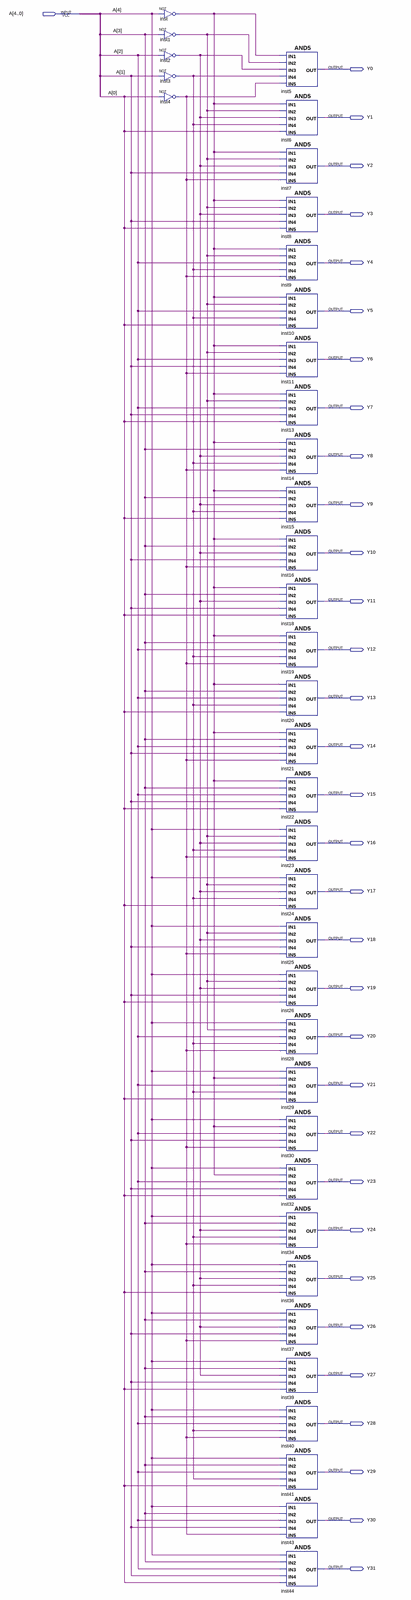
[diagram p0: schematic sheet, whole]
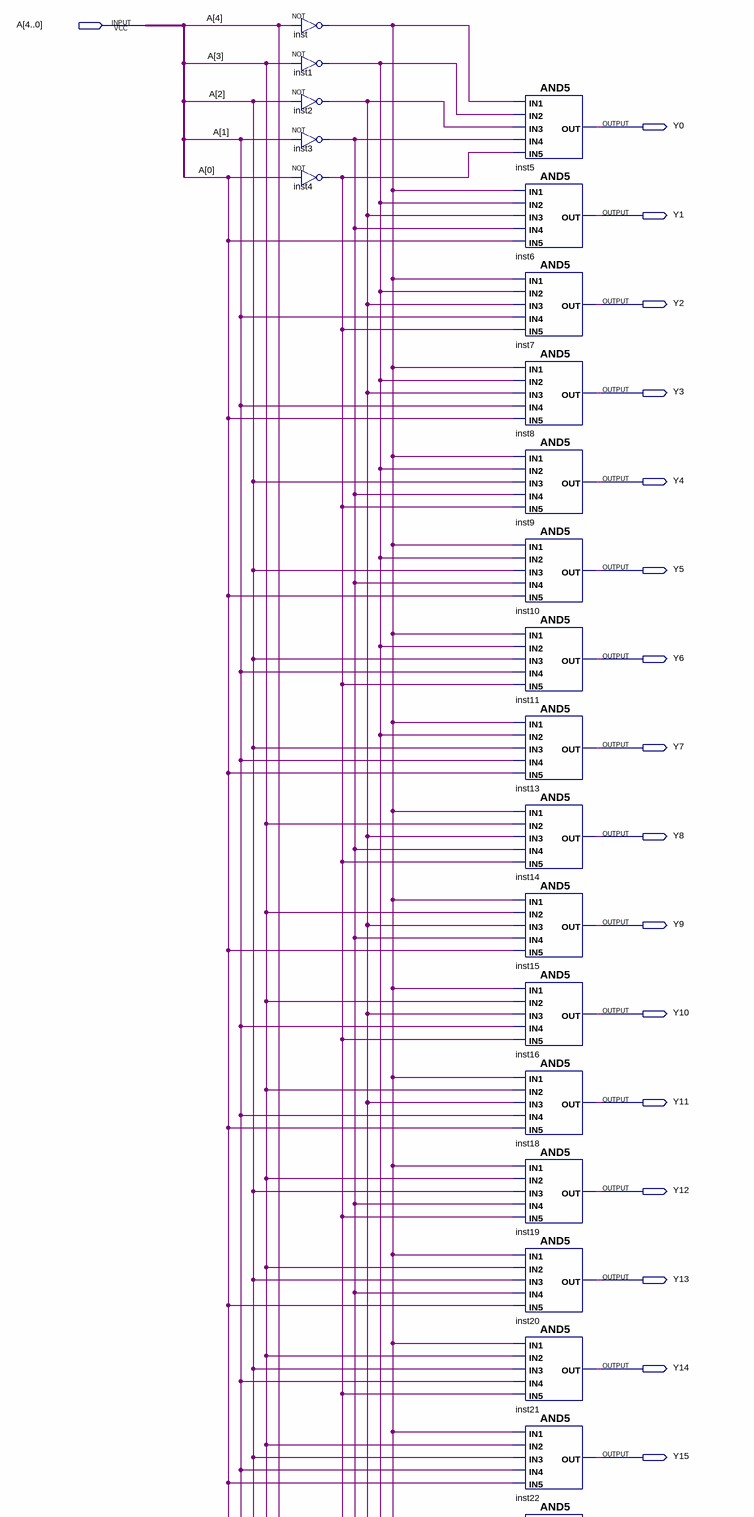
[diagram p1: schematic sheet, upper part]
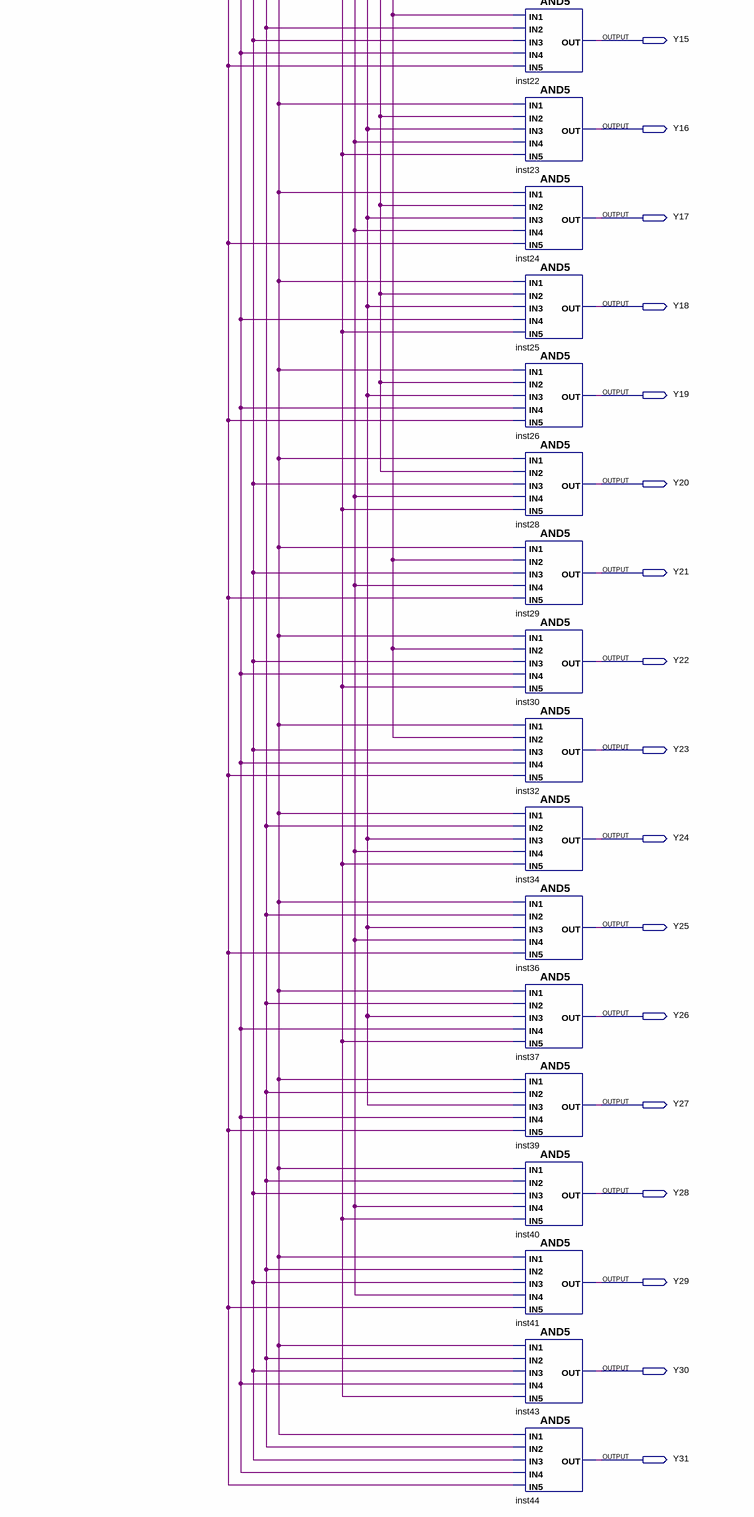
[diagram p2: schematic sheet, lower part]
// Quartus schematic decoder532.bdf as structural Verilog: 37 symbols, 33 pins
module decoder532 (
  input  [4:0] A,
  output Y0,
  output Y1,
  output Y2,
  output Y3,
  output Y4,
  output Y5,
  output Y6,
  output Y7,
  output Y8,
  output Y9,
  output Y10,
  output Y11,
  output Y12,
  output Y13,
  output Y14,
  output Y15,
  output Y16,
  output Y17,
  output Y18,
  output Y19,
  output Y20,
  output Y21,
  output Y22,
  output Y23,
  output Y24,
  output Y25,
  output Y26,
  output Y27,
  output Y28,
  output Y29,
  output Y30,
  output Y31
);

  wire inst1_out, inst2_out, inst3_out, inst4_out, inst_out;

  not inst (inst_out, A[4]);
  not inst1 (inst1_out, A[3]);
  not inst2 (inst2_out, A[2]);
  not inst3 (inst3_out, A[1]);
  not inst4 (inst4_out, A[0]);
  and inst5 (Y0, inst_out, inst1_out, inst2_out, inst3_out, inst4_out);
  and inst6 (Y1, inst_out, inst1_out, inst2_out, inst3_out, A[0]);
  and inst7 (Y2, inst_out, inst1_out, inst2_out, A[1], inst4_out);
  and inst8 (Y3, inst_out, inst1_out, inst2_out, A[1], A[0]);
  and inst9 (Y4, inst_out, inst1_out, A[2], inst3_out, inst4_out);
  and inst10 (Y5, inst_out, inst1_out, A[2], inst3_out, A[0]);
  and inst11 (Y6, inst_out, inst1_out, A[2], A[1], inst4_out);
  and inst13 (Y7, inst_out, inst1_out, A[2], A[1], A[0]);
  and inst14 (Y8, inst_out, A[3], inst2_out, inst3_out, inst4_out);
  and inst15 (Y9, inst_out, A[3], inst2_out, inst3_out, A[0]);
  and inst16 (Y10, inst_out, A[3], inst2_out, A[1], inst4_out);
  and inst18 (Y11, inst_out, A[3], inst2_out, A[1], A[0]);
  and inst19 (Y12, inst_out, A[3], A[2], inst3_out, inst4_out);
  and inst20 (Y13, inst_out, A[3], A[2], inst3_out, A[0]);
  and inst21 (Y14, inst_out, A[3], A[2], A[1], inst4_out);
  and inst22 (Y15, inst_out, A[3], A[2], A[1], A[0]);
  and inst23 (Y16, A[4], inst1_out, inst2_out, inst3_out, inst4_out);
  and inst24 (Y17, A[4], inst1_out, inst2_out, inst3_out, A[0]);
  and inst25 (Y18, A[4], inst1_out, inst2_out, A[1], inst4_out);
  and inst26 (Y19, A[4], inst1_out, inst2_out, A[1], A[0]);
  and inst28 (Y20, A[4], inst1_out, A[2], inst3_out, inst4_out);
  and inst29 (Y21, A[4], inst_out, A[2], inst3_out, A[0]);
  and inst30 (Y22, A[4], inst_out, A[2], A[1], inst4_out);
  and inst32 (Y23, A[4], inst_out, A[2], A[1], A[0]);
  and inst34 (Y24, A[4], A[3], inst2_out, inst3_out, inst4_out);
  and inst36 (Y25, A[4], A[3], inst2_out, inst3_out, A[0]);
  and inst37 (Y26, A[4], A[3], inst2_out, A[1], inst4_out);
  and inst39 (Y27, A[4], A[3], inst2_out, A[1], A[0]);
  and inst40 (Y28, A[4], A[3], A[2], inst3_out, inst4_out);
  and inst41 (Y29, A[4], A[3], A[2], inst3_out, A[0]);
  and inst43 (Y30, A[4], A[3], A[2], A[1], inst4_out);
  and inst44 (Y31, A[4], A[3], A[2], A[1], A[0]);
endmodule
